# Altium schematic sheet LEDS_Status.SchDoc
size Letter; Organization: Cegep Limoilou; Address1: 1300, 8e Avenue; Address2: Québec, QC; Address3: Canada; Address4: G1J 5L5; Revision: A; SheetNumber: 5; SheetTotal: 6; Conception: Thomas Lajoie; Titre: LEDs status; Modification: TL
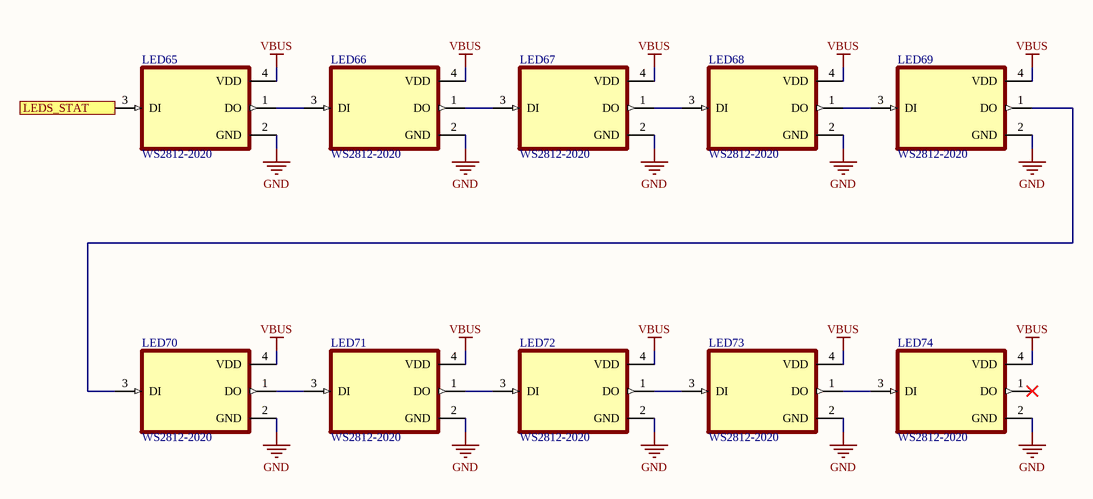
[diagram p0: LEDS_Status.SchDoc]

## Parts
LED65  WS2812-2020  [LED_WS2812-2020]
LED66  WS2812-2020  [LED_WS2812-2020]
LED67  WS2812-2020  [LED_WS2812-2020]
LED68  WS2812-2020  [LED_WS2812-2020]
LED69  WS2812-2020  [LED_WS2812-2020]
LED70  WS2812-2020  [LED_WS2812-2020]
LED71  WS2812-2020  [LED_WS2812-2020]
LED72  WS2812-2020  [LED_WS2812-2020]
LED73  WS2812-2020  [LED_WS2812-2020]
LED74  WS2812-2020  [LED_WS2812-2020]

## Ports
LEDS_STAT (in)

## Nets
GND: LED65.2(GND) LED66.2(GND) LED67.2(GND) LED68.2(GND) LED69.2(GND) LED70.2(GND) LED71.2(GND) LED72.2(GND) LED73.2(GND) LED74.2(GND)
VBUS: LED65.4(VDD) LED66.4(VDD) LED67.4(VDD) LED68.4(VDD) LED69.4(VDD) LED70.4(VDD) LED71.4(VDD) LED72.4(VDD) LED73.4(VDD) LED74.4(VDD)
LEDS_STAT: LED65.3(DI) ; port LEDS_STAT
NetLED65_1: LED65.1(DO) LED66.3(DI)
NetLED66_1: LED66.1(DO) LED67.3(DI)
NetLED67_1: LED67.1(DO) LED68.3(DI)
NetLED68_1: LED68.1(DO) LED69.3(DI)
NetLED69_1: LED69.1(DO) LED70.3(DI)
NetLED70_1: LED70.1(DO) LED71.3(DI)
NetLED71_1: LED71.1(DO) LED72.3(DI)
NetLED72_1: LED72.1(DO) LED73.3(DI)
NetLED73_1: LED73.1(DO) LED74.3(DI)

Not connected (* = marked no-connect by the designer): LED74 1(DO)*

## Notes on the sheet
- Titre :
- Conception :
- Date :
- Modification :
- Heure :
- Révision :
- Feuille
- de
- Fichier :

## Library data of the parts
LED65-LED74 = WS2812-2020: Intelligent control LED light source, SMD-4; MF: Worldsemi; MP: WS2812-2020; Availability: Not in stock; Package: Package; SnapEDA_Link: https://www.snapeda.com/parts/WS2812-2020/Worldsemi/view-part/?ref=snap; Check_prices: https://www.snapeda.com/parts/WS2812-2020/Worldsemi/view-part/?ref=eda; Value: *; Price: None